# Altium schematic sheet RAM_EMMC_Power.SchDoc
size A3; SheetNumber: 8; SheetTotal: 15
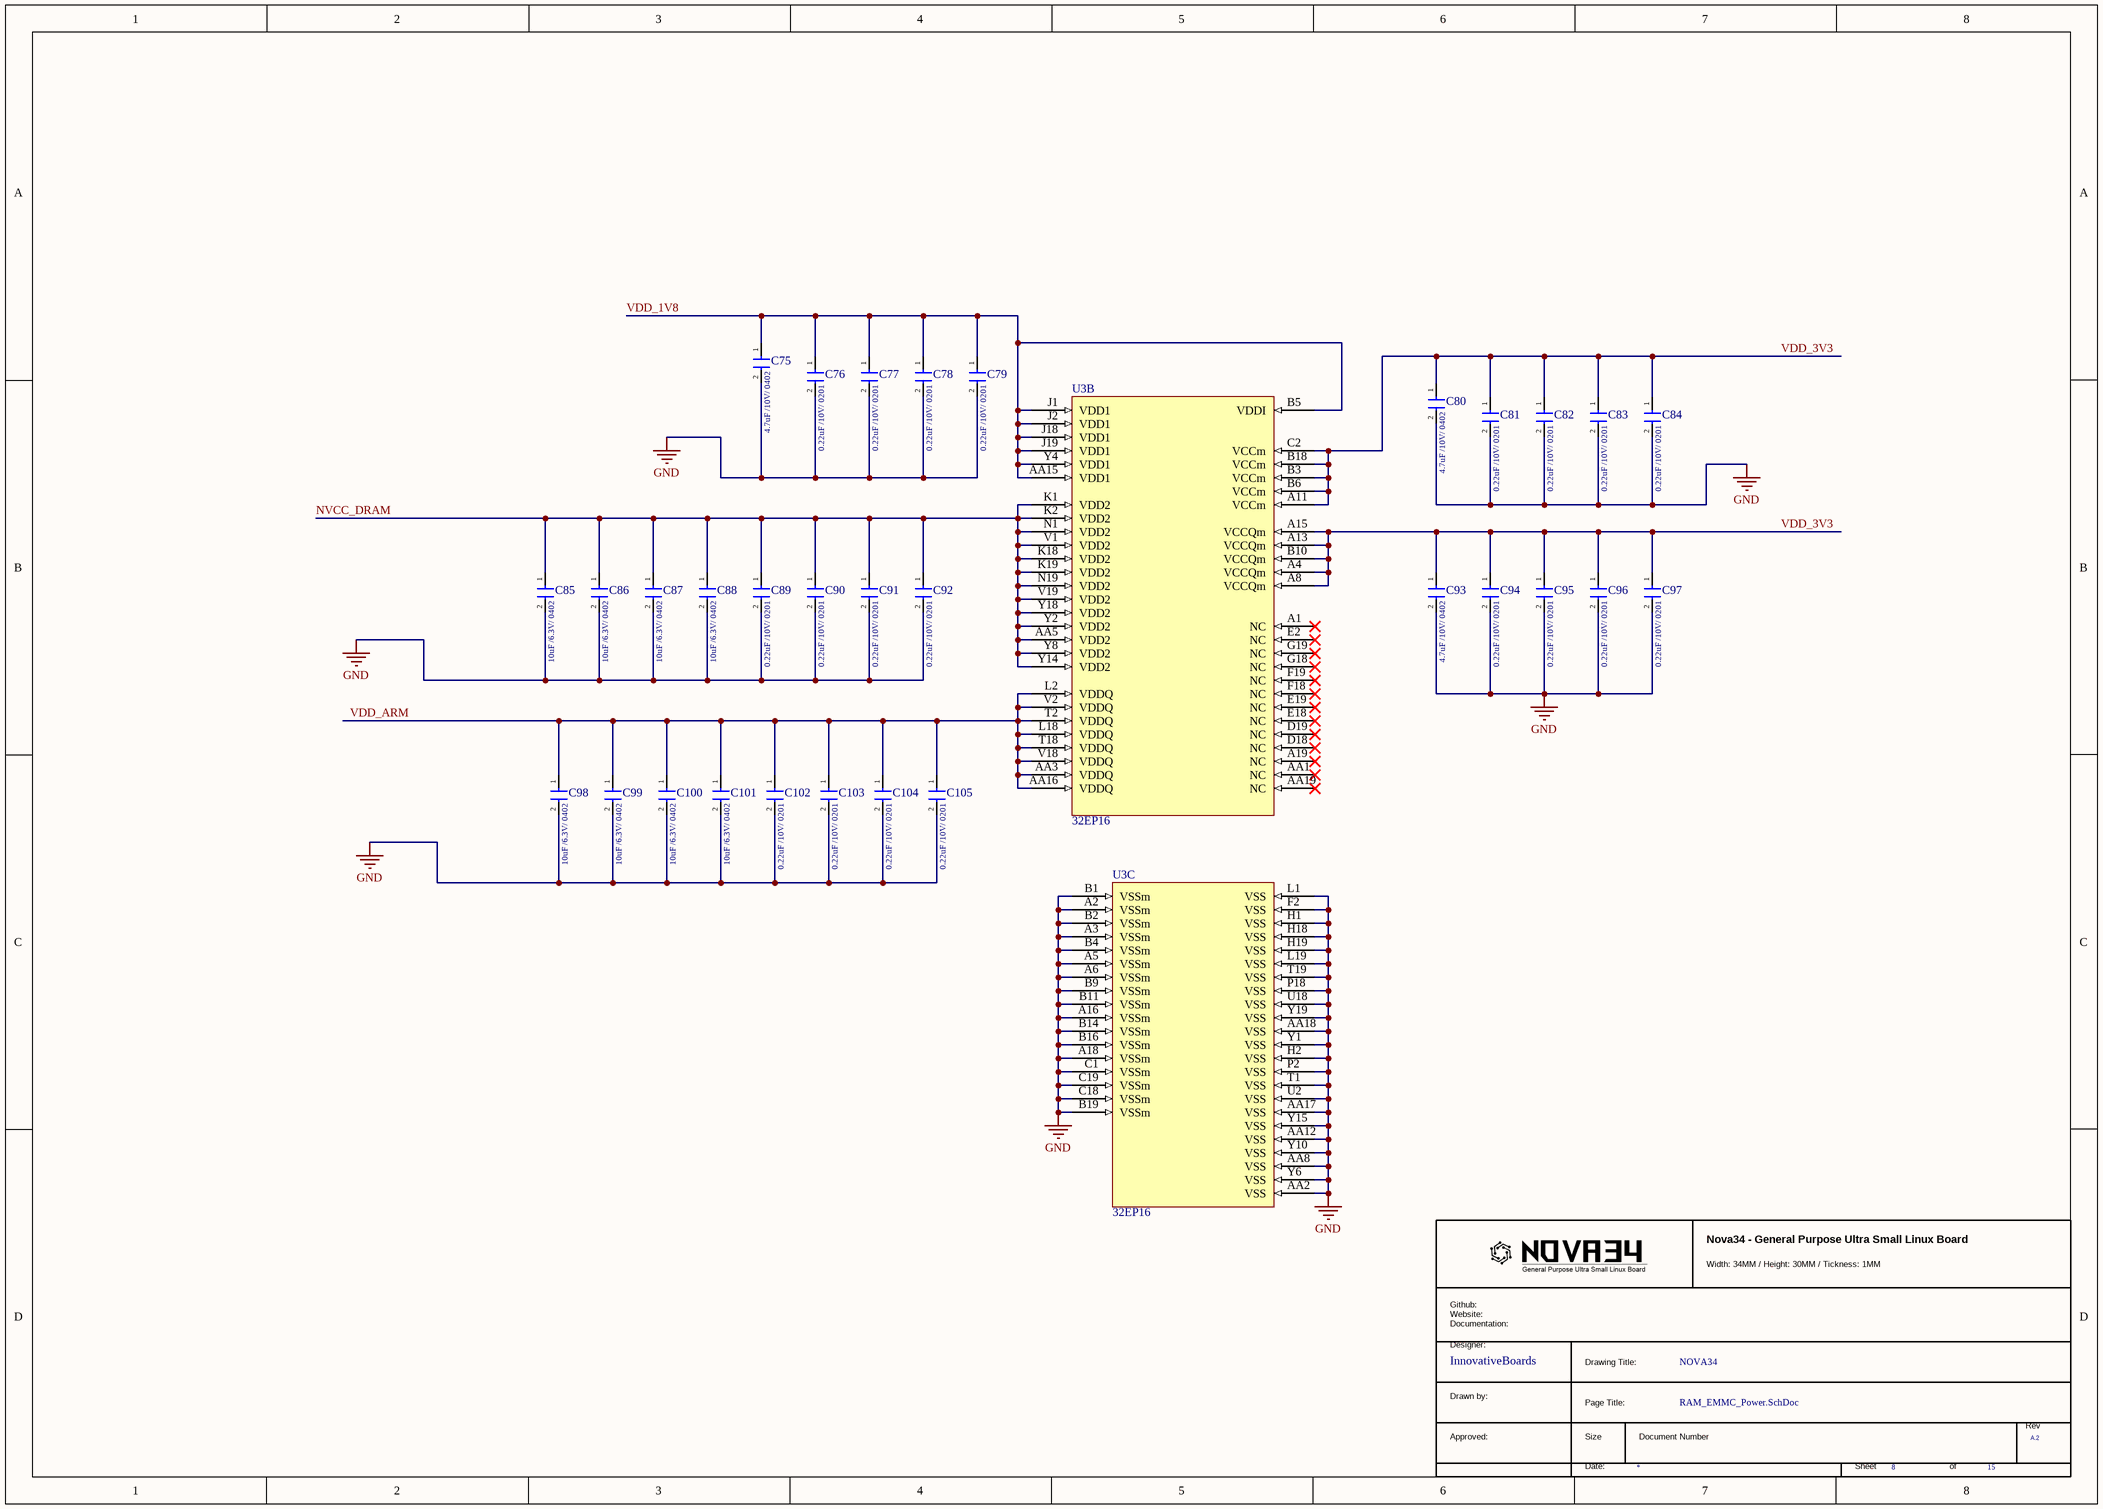
[diagram p0: RAM_EMMC_Power.SchDoc]

## Parts
*  RevCode: A.2  (hidden comment: TitleBlock_MCPG)  (graphical)
C75  4.7uF /10V/ 0402  [CAPC1005X70N]
C76  0.22uF /10V/ 0201  [GRM033D70J224ME01D]
C77  0.22uF /10V/ 0201  [GRM033D70J224ME01D]
C78  0.22uF /10V/ 0201  [GRM033D70J224ME01D]
C79  0.22uF /10V/ 0201  [GRM033D70J224ME01D]
C80  4.7uF /10V/ 0402  [CAPC1005X70N]
C81  0.22uF /10V/ 0201  [GRM033D70J224ME01D]
C82  0.22uF /10V/ 0201  [GRM033D70J224ME01D]
C83  0.22uF /10V/ 0201  [GRM033D70J224ME01D]
C84  0.22uF /10V/ 0201  [GRM033D70J224ME01D]
C85  10uF /6.3V/ 0402  [CAPC1005X65N]
C86  10uF /6.3V/ 0402  [CAPC1005X65N]
C87  10uF /6.3V/ 0402  [CAPC1005X65N]
C88  10uF /6.3V/ 0402  [CAPC1005X65N]
C89  0.22uF /10V/ 0201  [GRM033D70J224ME01D]
C90  0.22uF /10V/ 0201  [GRM033D70J224ME01D]
C91  0.22uF /10V/ 0201  [GRM033D70J224ME01D]
C92  0.22uF /10V/ 0201  [GRM033D70J224ME01D]
C93  4.7uF /10V/ 0402  [CAPC1005X70N]
C94  0.22uF /10V/ 0201  [GRM033D70J224ME01D]
C95  0.22uF /10V/ 0201  [GRM033D70J224ME01D]
C96  0.22uF /10V/ 0201  [GRM033D70J224ME01D]
C97  0.22uF /10V/ 0201  [GRM033D70J224ME01D]
C98  10uF /6.3V/ 0402  [CAPC1005X65N]
C99  10uF /6.3V/ 0402  [CAPC1005X65N]
C100  10uF /6.3V/ 0402  [CAPC1005X65N]
C101  10uF /6.3V/ 0402  [CAPC1005X65N]
C102  0.22uF /10V/ 0201  [GRM033D70J224ME01D]
C103  0.22uF /10V/ 0201  [GRM033D70J224ME01D]
C104  0.22uF /10V/ 0201  [GRM033D70J224ME01D]
C105  0.22uF /10V/ 0201  [GRM033D70J224ME01D]
U3  32EP16  [BGA144C40P19X21_800X950X80]  (parts B,C of 3)

## Nets
GND: C75.2 C76.2 C77.2 C78.2 C79.2 C80.2 C81.2 C82.2 C83.2 C84.2 C85.2 C86.2 C87.2 C88.2 C89.2 C90.2 C91.2 C92.2 C93.2 C94.2 C95.2 C96.2 C97.2 C98.2 C99.2 C100.2 C101.2 C102.2 C103.2 C104.2 C105.2 U3.A2(VSSm) U3.A3(VSSm) U3.A5(VSSm) U3.A6(VSSm) U3.A16(VSSm) U3.A18(VSSm) U3.AA2(VSS) U3.AA8(VSS) U3.AA12(VSS) U3.AA17(VSS) U3.AA18(VSS) U3.B1(VSSm) U3.B2(VSSm) U3.B4(VSSm) U3.B9(VSSm) U3.B11(VSSm) U3.B14(VSSm) U3.B16(VSSm) U3.B19(VSSm) U3.C1(VSSm) U3.C18(VSSm) U3.C19(VSSm) U3.F2(VSS) U3.H1(VSS) U3.H2(VSS) U3.H18(VSS) U3.H19(VSS) U3.L1(VSS) U3.L19(VSS) U3.P2(VSS) U3.P18(VSS) U3.T1(VSS) U3.T19(VSS) U3.U2(VSS) U3.U18(VSS) U3.Y1(VSS) U3.Y6(VSS) U3.Y10(VSS) U3.Y15(VSS) U3.Y19(VSS)
NVCC_DRAM: C85.1 C86.1 C87.1 C88.1 C89.1 C90.1 C91.1 C92.1 U3.AA5(VDD2) U3.K1(VDD2) U3.K2(VDD2) U3.K18(VDD2) U3.K19(VDD2) U3.N1(VDD2) U3.N19(VDD2) U3.V1(VDD2) U3.V19(VDD2) U3.Y2(VDD2) U3.Y8(VDD2) U3.Y14(VDD2) U3.Y18(VDD2)
VDD_1V8: C75.1 C76.1 C77.1 C78.1 C79.1 U3.AA15(VDD1) U3.B5(VDDI) U3.J1(VDD1) U3.J2(VDD1) U3.J18(VDD1) U3.J19(VDD1) U3.Y4(VDD1)
VDD_3V3: C80.1 C81.1 C82.1 C83.1 C84.1 C93.1 C94.1 C95.1 C96.1 C97.1 U3.A4(VCCQm) U3.A8(VCCQm) U3.A11(VCCm) U3.A13(VCCQm) U3.A15(VCCQm) U3.B3(VCCm) U3.B6(VCCm) U3.B10(VCCQm) U3.B18(VCCm) U3.C2(VCCm)
VDD_ARM: C98.1 C99.1 C100.1 C101.1 C102.1 C103.1 C104.1 C105.1 U3.AA3(VDDQ) U3.AA16(VDDQ) U3.L2(VDDQ) U3.L18(VDDQ) U3.T2(VDDQ) U3.T18(VDDQ) U3.V2(VDDQ) U3.V18(VDDQ)

Not connected (* = marked no-connect by the designer): U3 A1(NC)* A19(NC)* AA1(NC)* AA19(NC)* D18(NC)* D19(NC)* E2(NC)* E18(NC)* E19(NC)* F18(NC)* F19(NC)* G18(NC)* G19(NC)*

## Notes on the sheet
- (in symbol TitleBlock_MCPG) Nova34 - General Purpose Ultra Small Linux Board; Width: 34MM / Height: 30MM / Tickness: 1MM; Github: / Website: / Documentation:; Designer:; InnovativeBoards; Drawing Title:; NOVA34; Drawn by:; Page Title:; Rev; Approved:; Size; Document Number; Date:; Sheet; of

## Library data of the parts
C75 C80 C93 = GRT155C81A475ME13J: Multilayer Ceramic Capacitors MLCC - SMD/SMT 0402 X6S 4.7 F 20 10VDC AEC-Q200; Manufacturer_Name: Murata Electronics; Datasheet Link: https://search.murata.co.jp/Ceramy/image/img/A01X/G101/ENG/GRT155C81A475ME13-01A.pdf; Height: 0.7mm; Manufacturer_Part_Number: GRT155C81A475ME13J; Mouser Part Number: 81-GRT155C81A475ME3J; Mouser Price/Stock: https://www.mouser.co.uk/ProductDetail/Murata-Electronics/GRT155C81A475ME13J?qs=ufv2HEpFn%252BS%252BPUDm1eQCHw%3D%3D
C76-C79 C81-C84 C89-C92 C94-C97 C102-C105 = GRM033C81A224KE01J: Multilayer Ceramic Capacitors MLCC - SMD/SMT 0201 10VDC 0.22 F 10 X6S; Manufacturer_Name: Murata Electronics; Datasheet Link: https://search.murata.co.jp/Ceramy/image/img/A01X/G101/ENG/GRM033C81A224KE01-01A.pdf; Height: 0.33mm; Manufacturer_Part_Number: GRM033C81A224KE01J; Mouser Part Number: 81-GRM033C81A224KE1J; Mouser Price/Stock: https://www.mouser.co.uk/ProductDetail/Murata-Electronics/GRM033C81A224KE01J?qs=ufv2HEpFn%252BSIVjJJafvajA%3D%3D
C85-C88 C98-C101 = GRM155R60J106ME15D: Multilayer Ceramic Capacitors MLCC - SMD/SMT 10 uF 6.3 VDC 20% 0402 X5R; Manufacturer_Name: Murata Electronics; Datasheet Link: https://search.murata.co.jp/Ceramy/image/img/A01X/G101/ENG/GRM155R60J106ME15-01A.pdf; Height: 0.65mm; Manufacturer_Part_Number: GRM155R60J106ME15D; Mouser Part Number: 81-GRM155R60J106ME5D; Mouser Price/Stock: https://www.mouser.co.uk/ProductDetail/Murata-Electronics/GRM155R60J106ME15D?qs=I53XXhTNm8s65u6%252BR3mHqw%3D%3D; Arrow Part Number: GRM155R60J106ME15D; Arrow Price/Stock: https://www.arrow.com/en/products/grm155r60j106me15d/murata-manufacturing?region=nac
* = TitleBlock_MCPG: Page Create Date: March  8, 1995